# EasyEDA schematic 6502 Debugger_2020-04-26_19-41-09.json
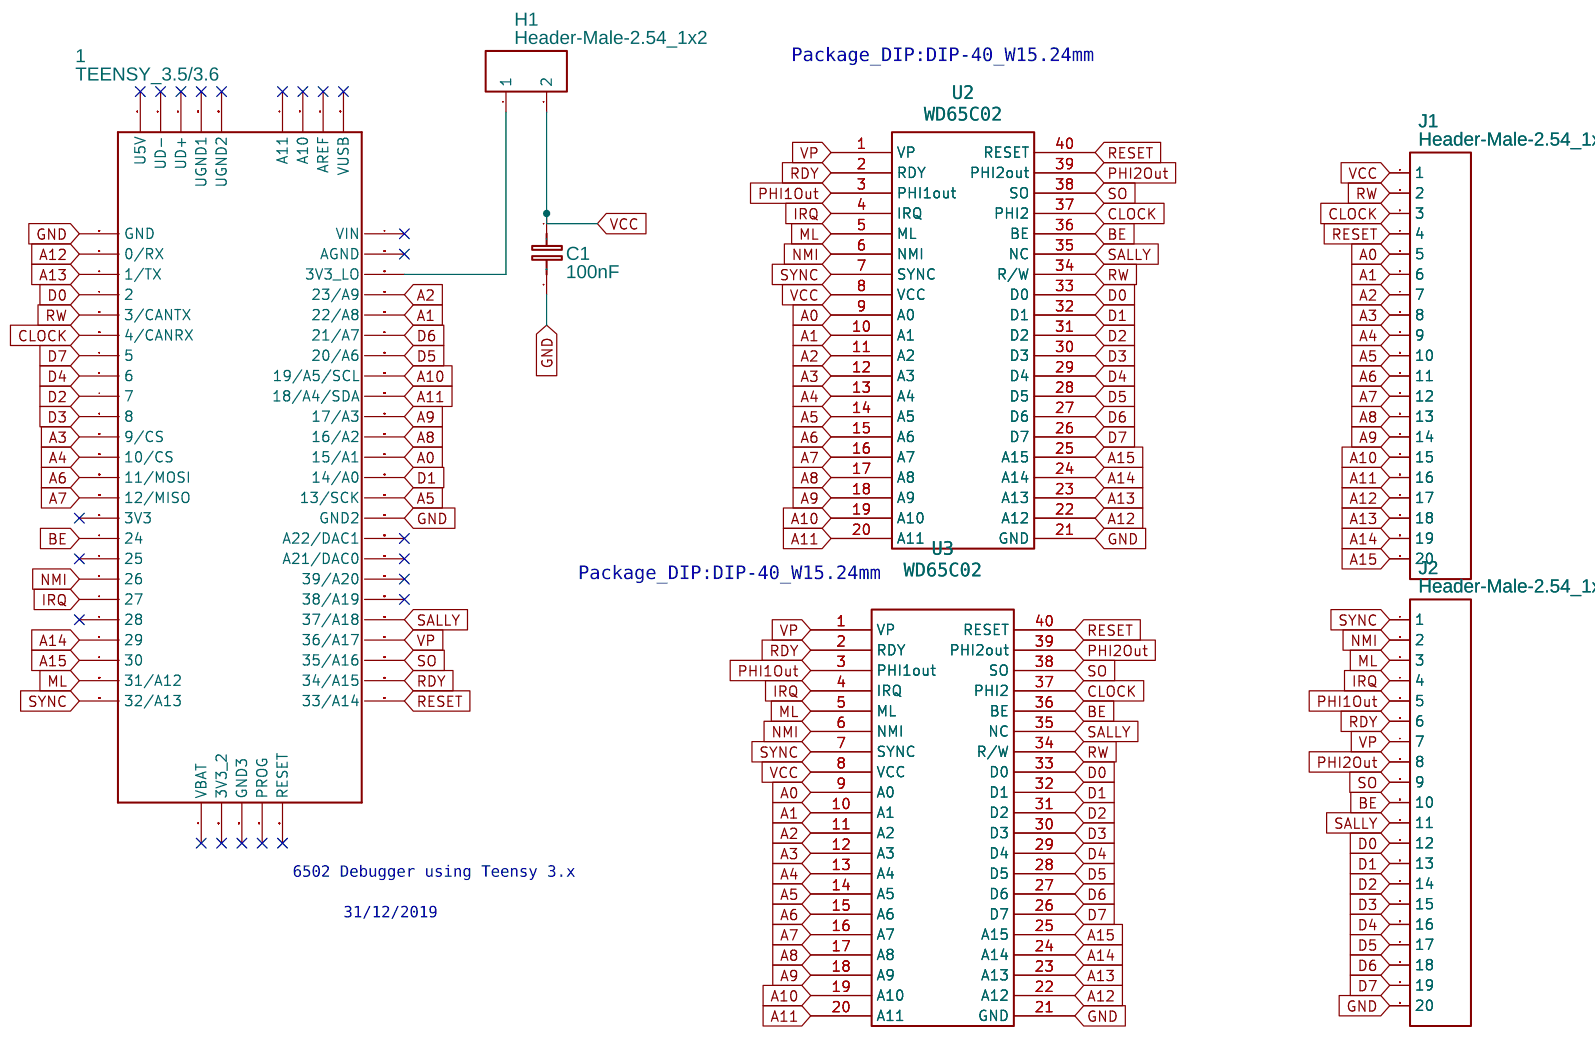
[diagram p0: schematic sheet]

## Parts
1  TEENSY_3.5/3.6  [TEENSY_3.5/3.6]
C1  100nF  [RAD-0.1]
H1  Header-Male-2.54_1x2  [HDR-2X1/2.54]
J1  Header-Male-2.54_1x20  [HDR-TH_20PIN-V-MALE-PITCH2.54]
J2  Header-Male-2.54_1x20  [HDR-TH_20PIN-V-MALE-PITCH2.54]
U2  WD65C02  [DIP-40_W15.24MM]
U3  WD65C02  [DIP-40_W15.24MM]

## Library data of the parts
1 = TEENSY_3.5/3.6: Contributor: Nathan Myaz
C1 = Cap_RAD-0.1_EU
H1 = Header-Male-2.54_1x2: Supplier: LCSC; Manufacturer: TE Connectivity; Manufacturer Part: 826629-2; image: //image.lceda.cn/szlcsc/C86471.jpg; Supplier Part: C86471
J1 J2 = Header-Male-2.54_1x20: Supplier: LCSC; Manufacturer: BOOMELE; Manufacturer Part: 2.54mm 1*20PHeader; image: //image.lceda.cn/szlcsc/C50981.jpg; Supplier Part: C50981

## Nets
GND: 1.GND 1.GND2 C1.2 J2.20 U2.21(GND) U3.21(GND)
VCC: C1.1 H1.2 J1.1 U2.8(VCC) U3.8(VCC)
A0: 1.15/A1 J1.5 U2.9(A0) U3.9(A0)
A1: 1.22/A8 J1.6 U2.10(A1) U3.10(A1)
A2: 1.23/A9 J1.7 U2.11(A2) U3.11(A2)
A3: 1.9/CS J1.8 U2.12(A3) U3.12(A3)
A4: 1.10/CS J1.9 U2.13(A4) U3.13(A4)
A5: 1.13/SCK J1.10 U2.14(A5) U3.14(A5)
A6: 1.11/MOSI J1.11 U2.15(A6) U3.15(A6)
A7: 1.12/MISO J1.12 U2.16(A7) U3.16(A7)
A8: 1.16/A2 J1.13 U2.17(A8) U3.17(A8)
A9: 1.17/A3 J1.14 U2.18(A9) U3.18(A9)
A10: 1.19/A5/SCL J1.15 U2.19(A10) U3.19(A10)
A11: 1.18/A4/SDA J1.16 U2.20(A11) U3.20(A11)
A12: 1.0/RX J1.17 U2.22(A12) U3.22(A12)
A13: 1.1/TX J1.18 U2.23(A13) U3.23(A13)
A14: 1.29 J1.19 U2.24(A14) U3.24(A14)
A15: 1.30 J1.20 U2.25(A15) U3.25(A15)
BE: 1.24 J2.10 U2.36(BE) U3.36(BE)
CLOCK: 1.4/CANRX J1.3 U2.37(PHI2) U3.37(PHI2)
D0: 1.2 J2.12 U2.33(D0) U3.33(D0)
D1: 1.14/A0 J2.13 U2.32(D1) U3.32(D1)
D2: 1.7 J2.14 U2.31(D2) U3.31(D2)
D3: 1.8 J2.15 U2.30(D3) U3.30(D3)
D4: 1.6 J2.16 U2.29(D4) U3.29(D4)
D5: 1.20/A6 J2.17 U2.28(D5) U3.28(D5)
D6: 1.21/A7 J2.18 U2.27(D6) U3.27(D6)
D7: 1.5 J2.19 U2.26(D7) U3.26(D7)
IRQ: 1.27 J2.4 U2.4(IRQ) U3.4(IRQ)
ML: 1.31/A12 J2.3 U2.5(ML) U3.5(ML)
NMI: 1.26 J2.2 U2.6(NMI) U3.6(NMI)
PHI1Out: J2.5 U2.3(PHI1out) U3.3(PHI1out)
PHI2Out: J2.8 U2.39(PHI2out) U3.39(PHI2out)
RDY: 1.34/A15 J2.6 U2.2(RDY) U3.2(RDY)
RESET: 1.33/A14 J1.4 U2.40(RESET) U3.40(RESET)
RW: 1.3/CANTX J1.2 U2.34(R/W) U3.34(R/W)
SALLY: 1.37/A18 J2.11 U2.35(NC) U3.35(NC)
SO: 1.35/A16 J2.9 U2.38(SO) U3.38(SO)
SYNC: 1.32/A13 J2.1 U2.7(SYNC) U3.7(SYNC)
VP: 1.36/A17 J2.7 U2.1(VP) U3.1(VP)
Net-(1-3V3_LO): 1.3V3_LO H1.1

Not connected (* = marked no-connect by the designer): 1 3V3* 3V3_2* 21/DAC0(A21/DAC0)* 25* 28* 38/A19* 39/A20* A10* A11* A22/DAC1* AGND* AREF* GND3* PROG* RESET* U5V* UD+* UD-* UGND1* UGND2* VBAT* VIN* VUSB*

## Notes on the sheet
- Package_DIP:DIP-40_W15.24mm
- Package_DIP:DIP-40_W15.24mm
- 6502 Debugger using Teensy 3.x
- 31/12/2019
